# EAGLE design Medium_switch_1 (EAGLE 9.6.2)
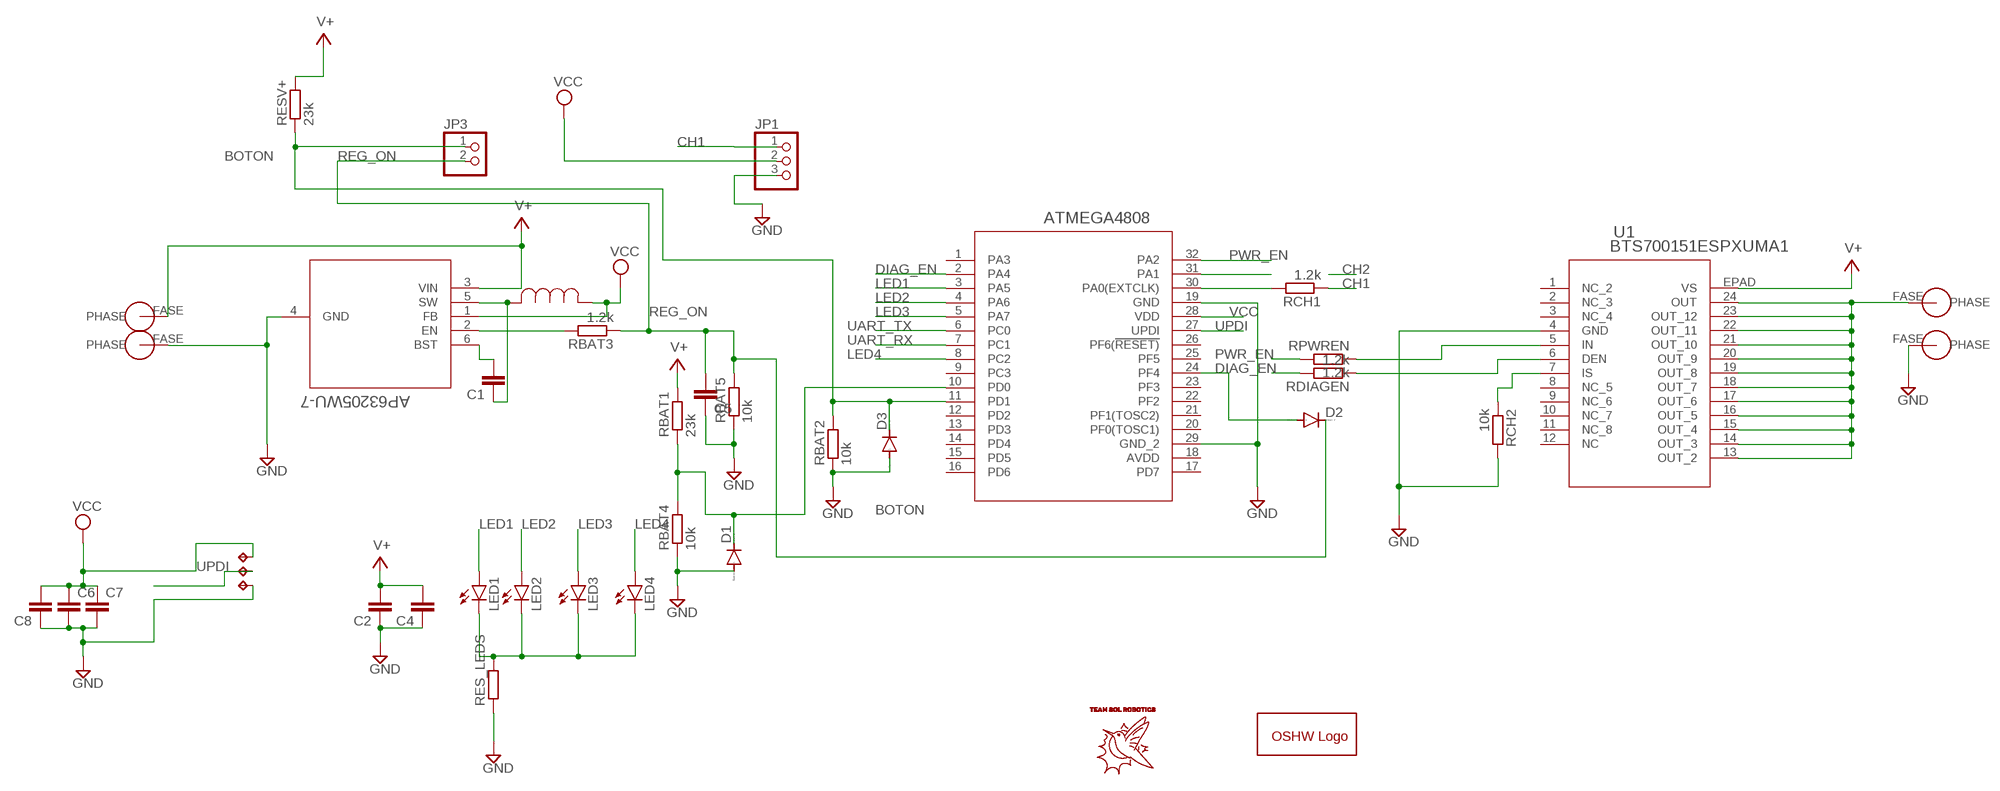
[diagram p0: schematic, sheet 1]

## Parts
BAT+  PHASE  [POWEROUT]
C1  C-EUC0402  [C0402]
C2  C-EUC1206  [C1206]
C4  C-EUC1206  [C1206]
C5  C-EUC0402  [C0402]
C6  C-EUC0805  [C0805]
C7  C-EUC0805  [C0805]
C8  C-EUC0402  [C0402]
D1  DIODE-MICROMELF-R  [MICROMELF-R]
D2  DIODE-MINIMELF  [MINIMELF]
D3  DIODE-MICROMELF-R  [MICROMELF-R]
FASEA1  PHASE  [POWEROUT]
FASEA3  PHASE  [POWEROUT]
GOLD_ORB_SM1  OSHWLOGOLOGO5MM  [OSHW_5MM]
JP1  PINHD-1X03_2.54-S  [1X03-S]
JP3  PINHD-1X02_2.00  [1X02M]
LED1  LEDSML0603  [SML0603]
LED2  LEDSML0603  [SML0603]
LED3  LEDSML0603  [SML0603]
LED4  LEDSML0603  [SML0603]
OUTPUTPWR  PHASE  [POWEROUT]
RBAT1  23k  R-EU_R0603  [R0603]
RBAT2  10k  R-EU_R0603  [R0603]
RBAT3  1.2k  R-EU_R0603  [R0603]
RBAT4  10k  R-EU_R0603  [R0603]
RBAT5  10k  R-EU_R0603  [R0603]
RCH1  1.2k  R-EU_R0603  [R0603]
RCH2  10k  R-EU_R0603  [R0603]
RDIAGEN  1.2k  R-EU_R0603  [R0603]
RES_LEDS  R-EU_R0603  [R0603]
RESV+  23k  R-EU_R0603  [R0603]
RPWREN  1.2k  R-EU_R0603  [R0603]
TP1  TPTP13SQ  [TP13SQ]
TP2  TPTP13SQ  [TP13SQ]
TP3  TPTP13SQ  [TP13SQ]
U1  BTS700151ESPXUMA1  [PG-TSDSO-24-32]
U2  AP63205WU-7  [SOIC_05WU-7_DIO]
U$1  ATMEGA4808  [QFP80P900X900X120-32N]
U$3  INDUCTOR4.7  [IND_NRS5030T100MMGJ_TAY]

## Nets
BOTON: D3.C JP3.1 RBAT2.2 RESV+.1 U$1.11(PD1)
CH1: JP1.1 RCH1.1
DIAG_EN: RDIAGEN.2 U$1.2(PA4)
GND: C2.1 C4.1 C5.1 C6.2 C7.2 C8.1 D1.A D3.A FASEA1.FASE(PHASE) FASEA3.FASE(PHASE) JP1.3 RBAT2.1 RBAT4.1 RBAT5.1 RCH2.2 RES_LEDS.1 TP2.TP U1.4(GND) U2.4(GND) U$1.19(GND) U$1.29(GND_2)
LED1: LED1.A U$1.3(PA5)
LED2: LED2.A U$1.4(PA6)
LED3: LED3.A U$1.5(PA7)
LED4: LED4.A U$1.8(PC2)
N$1: RBAT3.2 U2.2(EN)
N$2: LED1.C LED2.C LED3.C LED4.C RES_LEDS.2
N$3: RCH1.2 U$1.30(PA0(EXTCLK))
N$4: U$1.31(PA1)
N$5: D2.A U$1.24(PF4)
N$6: C1.1 U2.5(SW) U$3.2
N$7: RPWREN.1 U1.5(IN)
N$8: C1.2 U2.6(BST)
N$9: RDIAGEN.1 U1.6(DEN)
N$10: OUTPUTPWR.FASE(PHASE) U1.13(OUT_2) U1.14(OUT_3) U1.15(OUT_4) U1.16(OUT_5) U1.17(OUT_6) U1.18(OUT_7) U1.19(OUT_8) U1.20(OUT_9) U1.21(OUT_10) U1.22(OUT_11) U1.23(OUT_12) U1.24(OUT)
N$11: D1.C RBAT1.1 RBAT4.2 U$1.10(PD0)
N$12: RCH2.1 U1.7(IS)
PWR_EN: RPWREN.2 U$1.32(PA2)
REG_ON: C5.2 D2.C JP3.2 RBAT3.1 RBAT5.2
UART_RX: U$1.7(PC1)
UART_TX: U$1.6(PC0)
UPDI: TP3.TP U$1.27(UPDI)
V+: BAT+.FASE(PHASE) C2.2 C4.2 RBAT1.2 RESV+.2 U1.EPAD(VS) U2.3(VIN)
VCC: C6.1 C7.1 C8.2 JP1.2 TP1.TP U2.1(FB) U$1.28(VDD) U$3.1
Unconnected: U1.1(NC_2) U1.2(NC_3) U1.3(NC_4) U1.8(NC_5) U1.9(NC_6) U1.10(NC_7) U1.11(NC_8) U1.12(NC) U$1.1(PA3) U$1.9(PC3) U$1.12(PD2) U$1.13(PD3) U$1.14(PD4) U$1.15(PD5) U$1.16(PD6) U$1.17(PD7) U$1.20(PF0(TOSC1)) U$1.21(PF1(TOSC2)) U$1.22(PF2) U$1.23(PF3) U$1.25(PF5) U$1.26(PF6(!RESET))

## Power pins joined to a net without a drawn wire
AVDD: U$1.18(AVDD)

## Library data of the parts
BAT+ FASEA1 FASEA3 OUTPUTPWR = PHASE:PHASE
C1 C2 C4-C8 = rcl:C-EU: CAPACITOR, European symbol; SPICEPREFIX: C
D1-D3 = diode:DIODE-: DIODE
GOLD_ORB_SM1 = oshw:OSHWLOGO: The OSHW logo for PCB layout
JP1 = pinhead-2:PINHD-1X03: PIN HEADER
JP3 = pinhead-2:PINHD-1X02: PIN HEADER
LED1-LED4 = led:LED: LED OSRAM: - CHIPLED LG R971, LG N971, LY N971, LG Q971, LY Q971, LO R971, LY R971 LH N974, LH R974 LS Q976, LO Q976, LY Q976 LO Q996 - Hyper CHIPLED LW Q18S LB Q993, LB Q99A, LB R99A - SideLED LS A670, LO A670, LY A670, LG A670, LP A670 LB A673, LV A673, LT A673, LW A673 LH A674 LY A675 LS A676, LA A676, LO A676, LY A676, LW A676 LS A679, LY A679, LG A679 - Hyper Micro SIDELED® LS Y876, LA Y876, LO Y876, LY Y876 LT Y87S - SmartLED LW L88C, LW L88S LB L89C, LB L89S, LG L890 LS L89K, LO L89K, LY L89K LS L896, LA L896, LO L896, LY L896 - TOPLED LS T670, LO T670, LY T670, LG T670, LP T670 LSG T670, LSP T670, LSY T670, LOP T670, LYG T670 LG T671, LOG T671, LSG T671 LB T673, LV T673, LT T673, LW T673 LH T674 LS T676, LA T676, LO T676, LY T676, LB T676, LH T676, LSB T676, LW T676 LB T67C, LV T67C, LT T67C, LS T67K, LO T67K, LY T67K, LW E67C LS E67B, LA E67B, LO E67B, LY E67B, LB E67C, LV E67C, LT E67C LW T67C LS T679, LY T679, LG T679 LS T770, LO T770, LY T770, LG T770, LP T770 LB T773, LV T773, LT T773, LW T773 LH T774 LS E675, LA E675, LY E675, LS T675 LS T776, LA T776, LO T776, LY T776, LB T776 LHGB T686 LT T68C, LB T68C - Hyper Mini TOPLED® LB M676 - Mini TOPLED Santana® LG M470 LS M47K, LO M47K, LY M47K Source: http://www.osram.convergy.de LUXEON: - LUMILED® LXK2-PW12-R00, LXK2-PW12-S00, LXK2-PW14-U00, LXK2-PW14-V00 LXK2-PM12-R00, LXK2-PM12-S00, LXK2-PM14-U00 LXK2-PE12-Q00, LXK2-PE12-R00, LXK2-PE12-S00, LXK2-PE14-T00, LXK2-PE14-U00 LXK2-PB12-K00, LXK2-PB12-L00, LXK2-PB12-M00, LXK2-PB14-N00, LXK2-PB14-P00, LXK2-PB14-Q00 LXK2-PR12-L00, LXK2-PR12-M00, LXK2-PR14-Q00, LXK2-PR14-R00 LXK2-PD12-Q00, LXK2-PD12-R00, LXK2-PD12-S00 LXK2-PH12-R00, LXK2-PH12-S00 LXK2-PL12-P00, LXK2-PL12-Q00, LXK2-PL12-R00 Source: www.luxeon.com KINGBRIGHT: KA-3528ASYC Source: www.kingbright.com
RBAT1-RBAT5 RCH1 RCH2 RDIAGEN RES_LEDS RESV+ RPWREN = rcl:R-EU_: RESISTOR, European symbol; SPICEPREFIX: R
TP1-TP3 = testpad:TP: Test pad
U1 = ProfetHighside:BTS700151ESPXUMA1; COPYRIGHT: Copyright (C) 2023 Ultra Librarian. All rights reserved.; DIGI-KEY_PART_NUMBER_1: 448-BTS700151ESPXUMA1TR-ND; DIGI-KEY_PART_NUMBER_2: 448-BTS700151ESPXUMA1CT-ND; DIGI-KEY_PART_NUMBER_3: 448-BTS700151ESPXUMA1DKR-ND; MANUFACTURER_PART_NUMBER: BTS700151ESPXUMA1; MFR_NAME: Infineon
U2 = AP63205WU-7:AP63205WU-7; BUILT_BY: EMA_Matt; COPYRIGHT: Copyright (C) 2018 Accelerated Designs. All rights reserved; MANUFACTURER_PART_NUMBER: AP63205WU-7; SOURCELIBRARY: Diodes_Inc_2019-12-05; VENDOR: Diodes Inc
U$1 = Atmega4808:ATMEGA4808
U$3 = Inductor4.7:INDUCTOR4.7

## Board
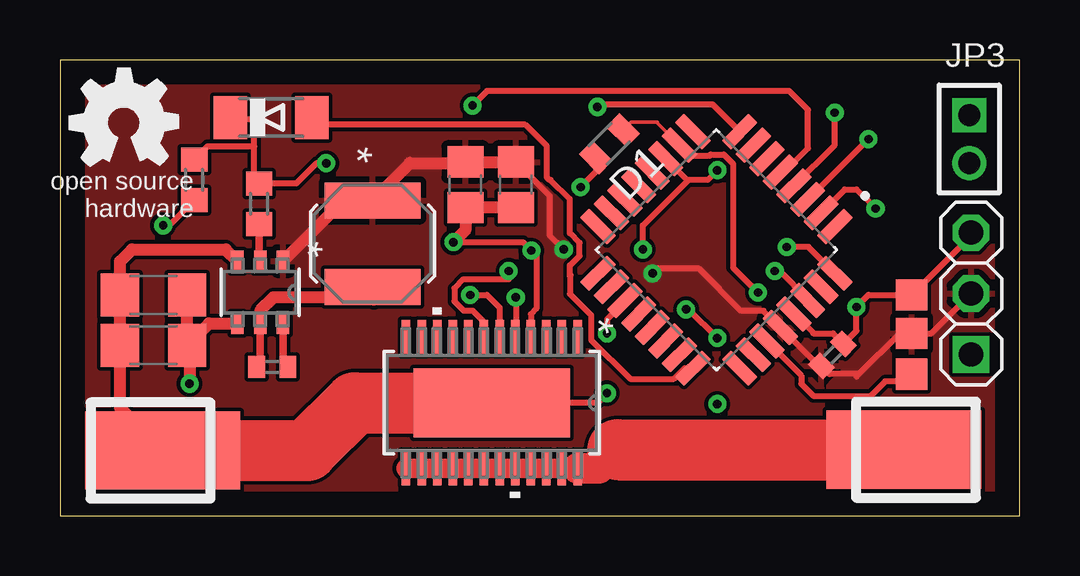
[diagram p1: board, top side]
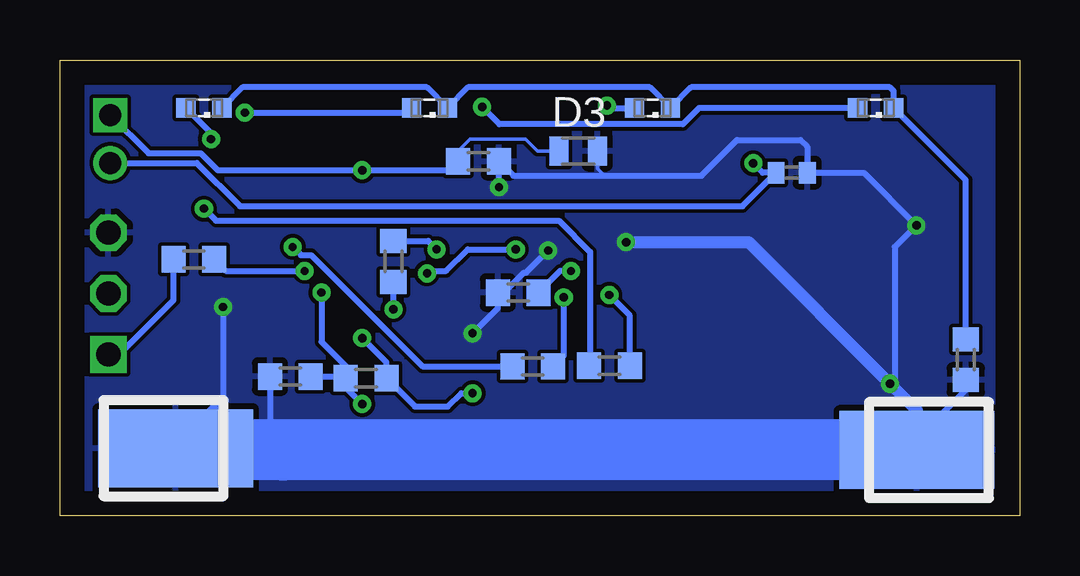
[diagram p2: board, bottom side, seen from below]

Size 40 x 19 mm. Coordinates in mm from the lower left corner, seen from the top.
Outline: 0,0 40,0 40,19 0,19 0,0
Copper layers (1*16): Top 0.035mm / dielectric 1.5mm / Bottom 0.035mm
Design rules "default": minimum track width 6mil, minimum drill 0.35mm, track to track 6mil, track to pad 6mil, pad to pad 6mil, via to via 6mil, smd to smd 6mil, copper to edge 40mil, drill to drill 6mil, minimum pad ring 10mil, minimum via ring 8mil, stop-mask expansion 4mil, vias tented up to drill 0mil, thermal gap 10mil

### Footprints (pad centres in the part's own frame; a part is rotated, then mirrored left to right if it is on the bottom)
POWEROUT = smd 3.251 x 6.452: FASE 0,0
C0402 = smd 0.7 x 0.9: 1 -0.65,0; 2 0.65,0
C1206 = smd 1.6 x 1.8: 1 -1.4,0; 2 1.4,0
C0805 = smd 1.3 x 1.5: 1 -0.95,0; 2 0.95,0
MICROMELF-R = smd 0.8 x 1.2: A 0.8,0; C -0.8,0
MINIMELF = smd 1.4 x 1.8: A 1.7,0; C -1.7,0
1X03-S = drill 1.016 square: 1 -2.54,0 | drill 1.016 octagon: 2 0,0; 3 2.54,0
1X02M = drill 0.914 square: 1 -1,0 | drill 0.914: 2 1,0
SML0603 = smd 0.8 x 0.8: A 0.75,0; C -0.75,0
R0603 = smd 1 x 1.1: 1 -0.85,0; 2 0.85,0
TP13SQ = smd 1.3 x 1.3: TP 0,0
PG-TSDSO-24-32 = smd 1.455 x 0.355: 1 -2.721,3.575; 2 -2.721,2.925; 3 -2.721,2.275; 4 -2.721,1.625; 5 -2.721,0.975; 6 -2.721,0.325; 7 -2.721,-0.325; 8 -2.721,-0.975; 9 -2.721,-1.625; 10 -2.721,-2.275; 11 -2.721,-2.925; 12 -2.721,-3.575; 13 2.721,-3.575; 14 2.721,-2.925; 15 2.721,-2.275; 16 2.721,-1.625; 17 2.721,-0.975; 18 2.721,-0.325; 19 2.721,0.325; 20 2.721,0.975; 21 2.721,1.625; 22 2.721,2.275; 23 2.721,2.925; 24 2.721,3.575 | smd 2.87 x 6.502: EPAD 0,0
SOIC_05WU-7_DIO = smd 0.896 x 0.517: 1 -1.299,0.95; 2 -1.299,0; 3 -1.299,-0.95; 4 1.299,-0.95; 5 1.299,0; 6 1.299,0.95
QFP80P900X900X120-32N = smd 1.6 x 0.55: 1 -4.18,2.8; 2 -4.18,2; 3 -4.18,1.2; 4 -4.18,0.4; 5 -4.18,-0.4; 6 -4.18,-1.2; 7 -4.18,-2; 8 -4.18,-2.8; 17 4.18,-2.8; 18 4.18,-2; 19 4.18,-1.2; 20 4.18,-0.4; 21 4.18,0.4; 22 4.18,1.2; 23 4.18,2; 24 4.18,2.8 | smd 0.55 x 1.6: 9 -2.8,-4.18; 10 -2,-4.18; 11 -1.2,-4.18; 12 -0.4,-4.18; 13 0.4,-4.18; 14 1.2,-4.18; 15 2,-4.18; 16 2.8,-4.18; 25 2.8,4.18; 26 2,4.18; 27 1.2,4.18; 28 0.4,4.18; 29 -0.4,4.18; 30 -1.2,4.18; 31 -2,4.18; 32 -2.8,4.18
IND_NRS5030T100MMGJ_TAY = smd 1.499 x 3.988: 1 -1.8,0; 2 1.8,0

### Placement (x,y rotation side)
BAT+  4.28,2.71 270 top
C1  8.85,6.2 0 top
C2  3.9,7.1 180 top
C4  3.9,9.2 180 top
C5  9.5,14.3 180 bottom
C6  16.9,13.8 270 top
C7  19,13.8 270 top
C8  32.2,6.7 225 top
D1  22.9,15.5 225 top
D2  8.8,16.6 0 top
D3  18.4,15.2 0 bottom
FASEA1  35.18,2.81 270 bottom
FASEA3  4.28,2.73 90 bottom
GOLD_ORB_SM1  2.66,16.38 0 top
JP1  37.98,9.26 90 top
JP3  37.9,15.7 270 top
LED1  34,17 180 bottom
LED2  24.6,17 180 bottom
LED3  15.3,17 180 bottom
LED4  6,17 180 bottom
OUTPUTPWR  35.18,2.75 90 top
RBAT1  27.24,5.73 0 bottom
RBAT2  22.55,14.77 180 bottom
RBAT3  8.3,13 270 top
RBAT4  30.4,5.8 0 bottom
RBAT5  5.6,14 90 top
RCH1  34.42,10.68 0 bottom
RCH2  20.9,9.3 180 bottom
RDIAGEN  17.09,6.25 180 bottom
RES_LEDS  2.24,6.5 90 bottom
RESV+  26.1,10.6 270 bottom
RPWREN  20.29,6.22 180 bottom
TP1  35.5,7.6 0 top
TP2  35.5,9.2 90 top
TP3  35.5,5.9 0 top
U1  18,4.7 270 top
U2  8.35,9.31 270 top
U$1  27.36,11.08 225 top
U$3  13.03,11.34 270 top

### Tracks (layer width: path | path; a pad name or v marks a point on that pad's centre or on a via)
BOTON  (via drill 0.35)
  Top 0.254: v27.4,14.4 27,14 26.2,14 | 26.2,14 26.14,14 U$1.11 | v24.3,11.1 24.3,12.1 26.2,14
  Bottom 0.152: D3.C 20.1,15.2 20.6,15.7 22.9,15.7 23.4,15.2 RBAT2.2
  Bottom 0.254: JP3.1 36.31,15.11 34.13,15.11 33.42,14.4 v27.4,14.4 23.77,14.4 RBAT2.2 | RESV+.1 24.65,11.45 v24.3,11.1
CH1
  Bottom 0.254: RCH1.1 35.27,8.98 37.53,6.72 JP1.1
DIAG_EN  (via drill 0.35)
  Top 0.254: U$1.2 32.71,13.6 33.2,13.6 v34,12.8
  Bottom 0.254: v34,12.8 33.5,12.3 19.2,12.3 17.9,11 17.9,6.29 RDIAGEN.2
GND  (via drill 0.35)
  Top 0.254: 30.65,8.41 U$1.29 31.4,7.61 31.4,7.6 32.22,7.6 C8.1 33.2,7.7 v33.2,8.7 33.7,9.2 TP2.TP | TP2.TP 37.98,11.68 JP1.3 | RBAT5.1 4.55,12.1 v4.3,12.1 | v16.4,11.4 19.3,11.4 v19.65,11.05 19.86,10.84 19.86,8.63 19.62,8.39 U1.4 | U$1.19 23.56,8.93 22.81,8.18 v22.81,7.61 v22.8,7.6 | 34.9,9.2 TP2.TP | D1.A 22.33,14.33 v21.7,13.7
  Top 0.508: C2.1 C4.1 | C2.1 6.21,8.01 U2.4 | C2.1 5.4,7 v5.4,5.5 | C7.2 C6.2 16.9,11.9 v16.4,11.4
  Bottom 0.152: D3.A 17.6,14.47 17.3,14.17
  Bottom 0.254: RES_LEDS.1 2.24,5.24 4.28,3.2 | 5.2,5.3 5.2,11.2 v4.3,12.1 6.5,14.3 C5.1 8.85,15.38 9.13,15.66 11.77,15.66 13.26,14.17 17.3,14.17 21.1,14.17 RBAT2.1 v21.7,13.7 | RBAT4.1 31.25,3.28 30.7,2.73 | v19.65,11.05 20.57,10.13 20.67,10.13 21.5,9.3 RCH2.2 21.75,8.65 v22.8,7.6 | v33.2,8.7 33.2,4.79
  Bottom 0.508: FASEA3.FASE 4.28,3.2 4.28,4.38 5.2,5.3 v5.4,5.5 11.3,11.4 v16.4,11.4 | 33.2,4.79 FASEA1.FASE
  Bottom 2.54: FASEA3.FASE 30.7,2.73 35.1,2.73 FASEA1.FASE
  pour Bottom: 0,0 0,19 40,19 40,0
LED1  (via drill 0.35)
  Top 0.254: v33.7,15.7 31.19,13.19 U$1.3
  Bottom 0.254: LED1.A 33.7,15.95 v33.7,15.7
LED2  (via drill 0.35)
  Top 0.254: U$1.4 32.3,15.45 v32.3,16.8
  Bottom 0.254: v32.3,16.8 25.55,16.8 LED2.A
LED3  (via drill 0.35)
  Top 0.254: U$1.5 30.19,14.32 31.18,15.31 31.18,16.92 30.4,17.7 17.8,17.7 v17.2,17.1
  Bottom 0.254: v17.2,17.1 17.1,17 LED3.A
LED4  (via drill 0.35)
  Top 0.254: v22.4,17.04 22.5,17.14 27.21,17.14 U$1.8
  Bottom 0.254: LED4.A 13.36,17 14.03,16.32 21.68,16.32 v22.4,17.04
N$1
  Top 0.305: U2.2 8.3,10.66 RBAT3.2
N$2
  Bottom 0.254: RES_LEDS.2 2.24,13.99 LED4.C 5.25,17.71 5.4,17.86 13.69,17.86 LED3.C 15.41,17.86 22.99,17.86 LED2.C 24.71,17.86 32.39,17.86 LED1.C
N$3  (via drill 0.35)
  Top 0.254: v29.8,10.2 30,10.2 31.16,9.04 U$1.30
  Bottom 0.254: RCH1.2 33.09,10.2 v29.8,10.2
N$5
  Top 0.254: 21.26,9.99 21.26,9.24 22.14,8.36 22.14,7.33 23.77,5.7 25.59,5.7 26.04,6.14 U$1.24 | 21.26,9.99 21.3,10.03 | D2.A 10.46,16.3 19.4,16.3 20.3,15.4 20.3,14.1 20.4,14 20.46,14 21.26,13.2 21.26,11.77 21.66,11.37 21.66,10.83 21.26,10.43 21.26,9.99
N$6
  Top 0.305: U2.5 8.35,6.35 C1.1
  Top 0.508: 13.09,9 U$3.2 12.59,9.1 8.9,9.1 8.35,8.55 U2.5
N$7  (via drill 0.35)
  Top 0.254: v19,9.1 19,7.45 U1.5
  Bottom 0.254: RPWREN.1 19,6.66 v19,9.1
N$8
  Top 0.305: U2.6 9.3,6.4 C1.2
N$9  (via drill 0.35)
  Top 0.254: v17.1,9.2 17.8,9.2 18.32,8.68 U1.6
  Bottom 0.254: RDIAGEN.1 16.24,8.34 v17.1,9.2
N$10
  Top 0.813: U1.13 U1.14 U1.15 U1.16 U1.17 U1.18 U1.19 U1.20 U1.21 U1.22 U1.23 U1.24
  Top 1.27: U1.24 22.48,1.98 23.25,2.75
  Top 2.54: 23.25,2.75 OUTPUTPWR.FASE
N$11  (via drill 0.35)
  Top 0.152: U$1.10 24.9,16.37 24.9,16.4 23.8,16.4 D1.C
  Top 0.254: U$1.10 26.26,15.01 27.07,15.01 27.13,15.06 27.67,15.06 28.06,14.67 28.06,10.34 v29.1,9.3
  Bottom 0.254: RBAT1.1 28.16,5.8 RBAT4.2 | RBAT1.1 28.09,5.34 v27.4,4.65 | v29.1,9.3 29.1,7.24 28.09,6.23 RBAT1.1
N$12  (via drill 0.35)
  Top 0.254: U1.7 17.68,8.07 17.2,8.54 16.83,8.54 16.44,8.93 16.44,9.47 16.83,9.86 18.7,9.86 v18.7,10.2
  Bottom 0.254: v18.7,10.2 19.15,10.2 RCH2.1
PWR_EN  (via drill 0.35)
  Top 0.254: U$1.32 31.2,11.2 v30.3,11.2
  Bottom 0.254: v30.3,11.2 29.96,10.86 29.53,10.86 24.89,6.22 RPWREN.2
REG_ON  (via drill 0.35)
  Top 0.254: 8.1,15.4 8.1,14.05 RBAT3.1 9.85,13.85 10.69,14.69 v11.1,14.69 | 8.1,15.4 8.1,16.49 D2.C | RBAT5.2 6.15,15.4 8.1,15.4
  Bottom 0.254: JP3.2 34.3,14.7 32.5,12.9 11.55,12.9 C5.2 10.71,14.3 v11.1,14.69
UPDI
  Top 0.254: U$1.27 30.9,5.84 30.9,5.5 31.4,5 33.8,5 34.4,5.6 35.2,5.6 TP3.TP
V+  (via drill 0.35)
  Top 0.254: v22.8,5.1 22.4,4.7 U1.EPAD | v27.4,7.4 26.2,8.6 v26.1,8.6
  Top 0.508: BAT+.FASE 2.5,4.49 C2.2 C4.2 2.5,10.6 3,11.1 6.91,11.1 U2.3
  Top 2.54: BAT+.FASE 10.31,2.71 12.3,4.7 U1.EPAD
  Bottom 0.254: v22.8,5.1 23.27,5.1 23.83,4.54 25.2,4.54 RBAT1.2 26.39,6.39 v27.4,7.4 | v26.1,8.6 RESV+.2
VCC  (via drill 0.35)
  Top 0.254: U$1.28 30.03,7.75 | 33.2,5.8 33.3,5.9 | 33.3,5.9 35,7.6 TP1.TP 36.32,7.6 JP1.2 | C7.1 20.41,13.34 20.41,11.69 v21,11.1 | U$1.28 29.33,8.54 28.39,8.54 26.63,10.3 24.9,10.3 v24.7,10.1 | U$1.28 31.63,6.24 C8.2 32.08,5.9 33.3,5.9
  Top 0.305: U$3.1 13.33,12.93
  Top 0.508: 11.98,12.69 U$3.1 | U2.1 11.83,13.14 U$3.1 | U$3.1 14.59,14.7 16.85,14.7 C6.1 C7.1
  Bottom 0.254: v24.7,10.1 24.6,10.2 23.9,10.2 23,11.1 v21,11.1
  pour Top: 0,0 0,19 40,19 40,0

### Text on the board
tValues: Diseñado en México